# EAGLE schematic rpusb (EAGLE 9.6.2)

## Sheet 1 of 4: Block Diagram
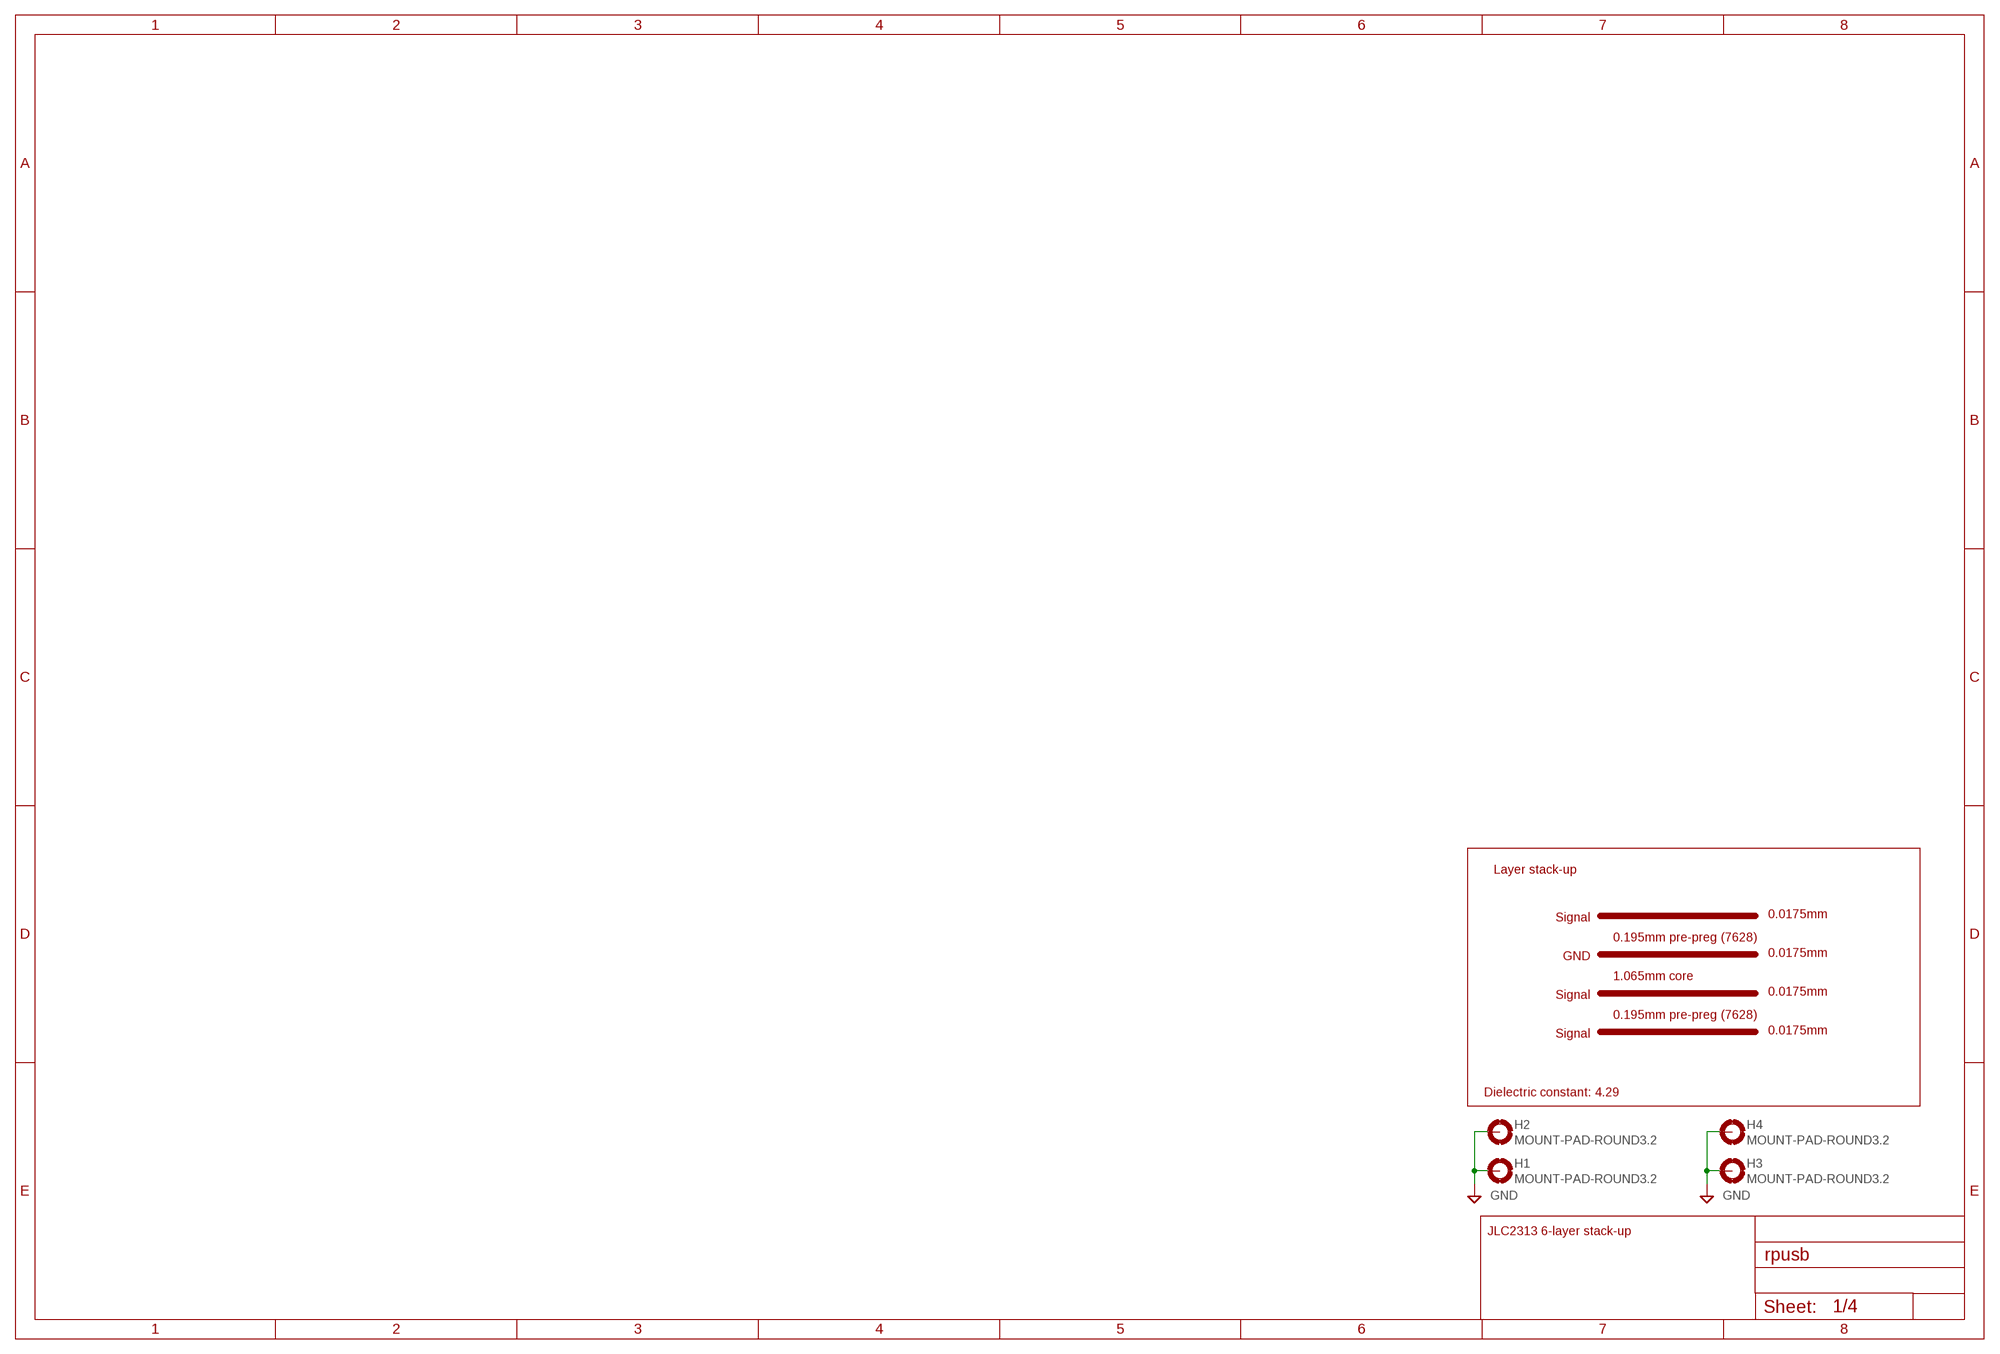
[diagram p0: schematic, sheet 1]

### Parts
H1  MOUNT-PAD-ROUND3.2  [3,2-PAD]
H2  MOUNT-PAD-ROUND3.2  [3,2-PAD]
H3  MOUNT-PAD-ROUND3.2  [3,2-PAD]
H4  MOUNT-PAD-ROUND3.2  [3,2-PAD]

### Nets
GND: H1.B3,2(MOUNT) H2.B3,2(MOUNT) H3.B3,2(MOUNT) H4.B3,2(MOUNT) ; also sheet 2,3,4

### Notes on the sheet
- Layer stack-up
- Signal
- 0.0175mm
- 0.195mm pre-preg (7628)
- GND
- 0.0175mm
- 1.065mm core
- Signal
- 0.0175mm
- 0.195mm pre-preg (7628)
- Signal
- 0.0175mm
- Dielectric constant: 4.29
- JLC2313 6-layer stack-up

## Sheet 2 of 4: USB hub
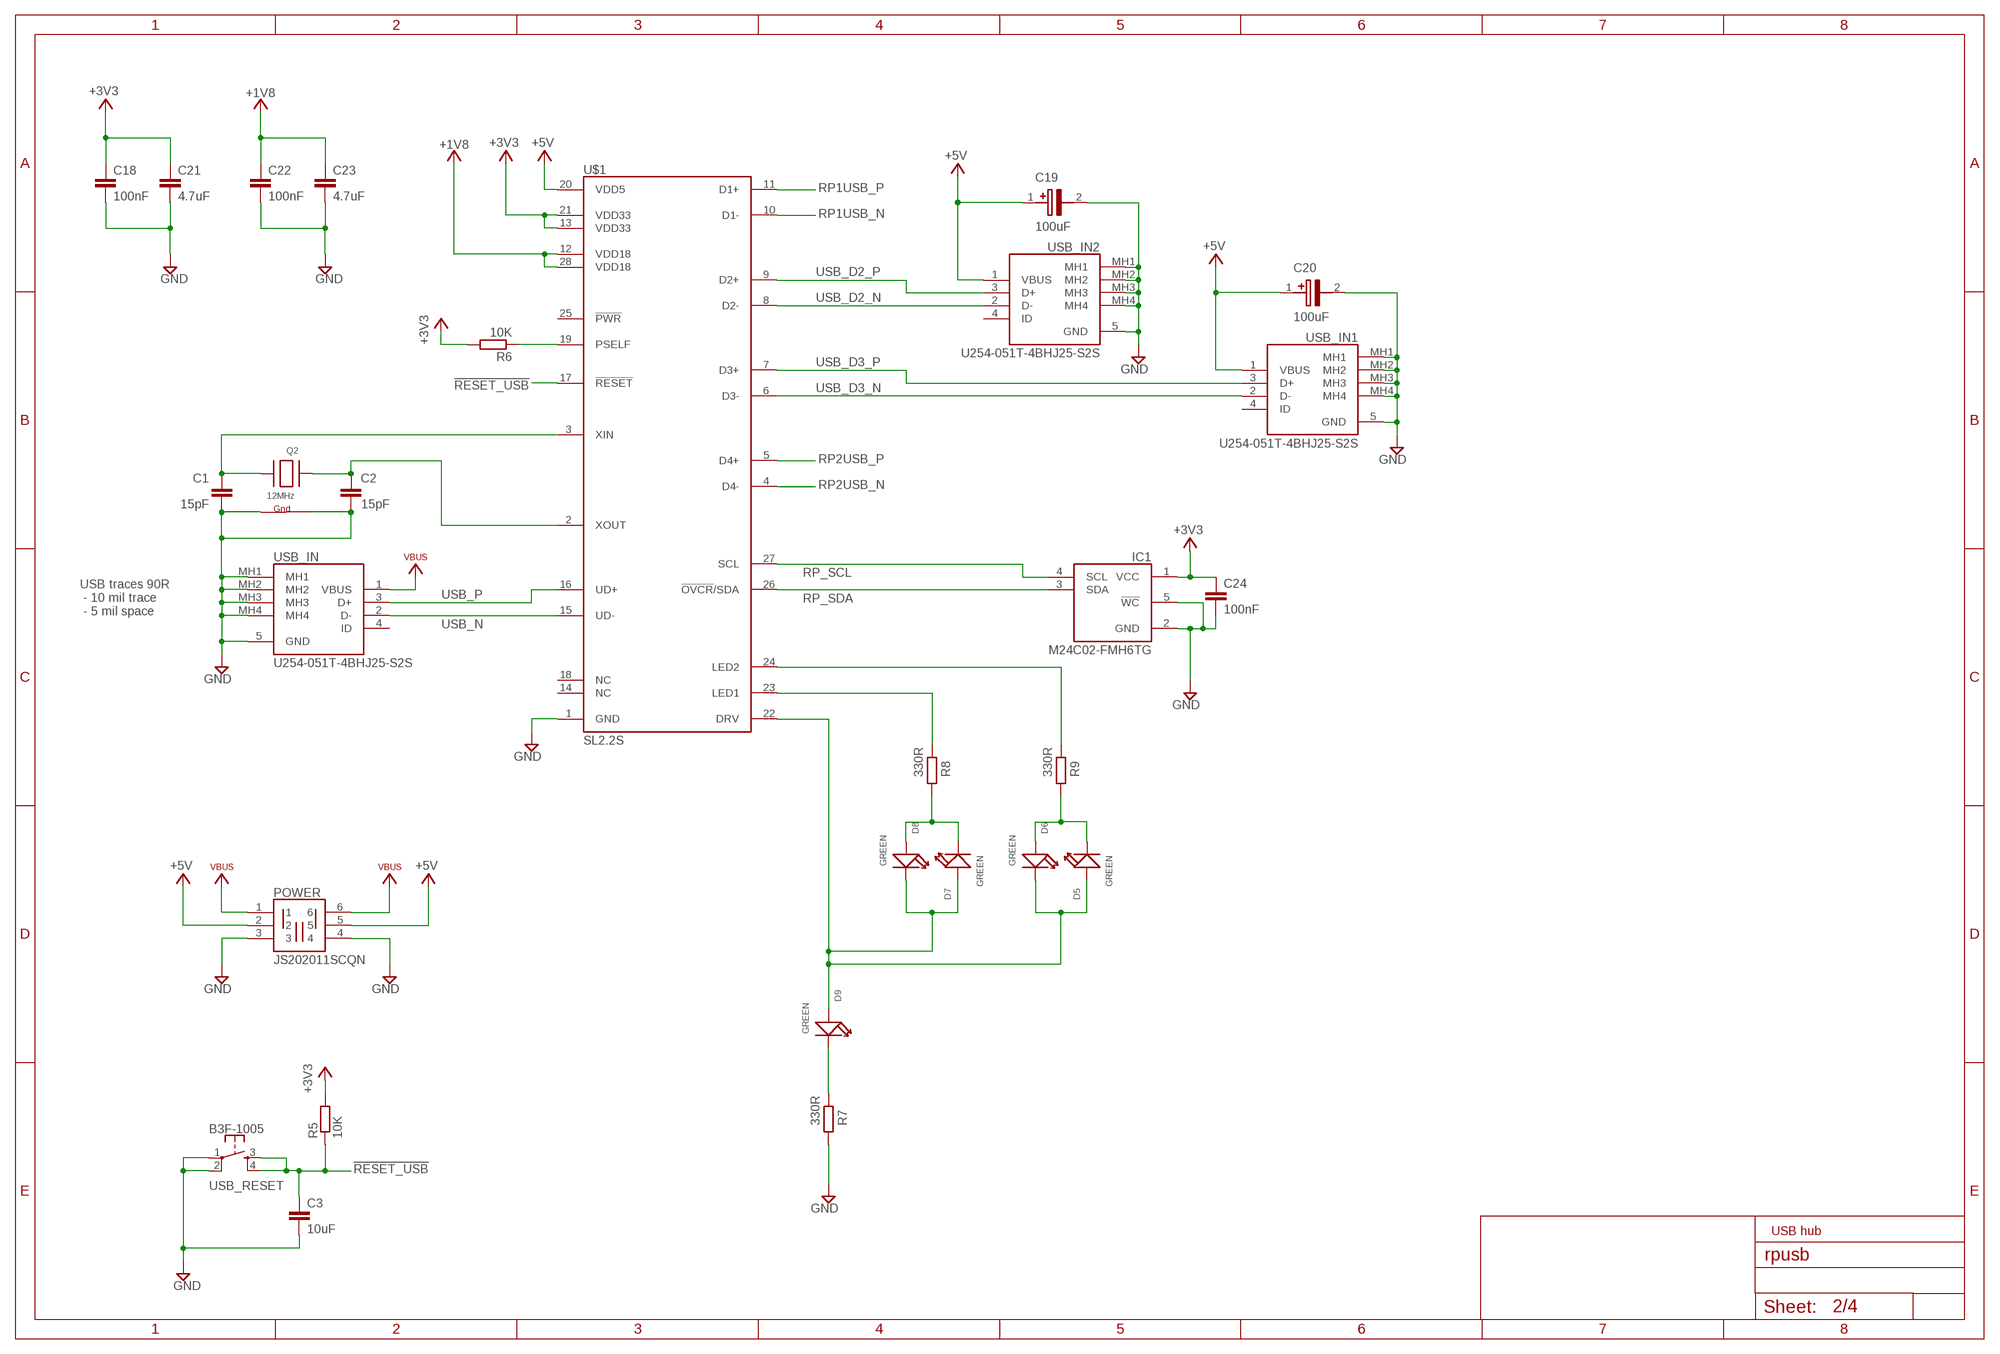
[diagram p1: schematic, sheet 2]

### Parts
C1  15pF  C-EUC0201  [C0201]
C2  15pF  C-EUC0201  [C0201]
C3  10uF  C-EUC0402  [C0402]
C18  100nF  C-EUC0201  [C0201]
C19  100uF  865080142007  [CAPAE530X550N]
C20  100uF  865080142007  [CAPAE530X550N]
C21  4.7uF  C-EUC0402  [C0402]
C22  100nF  C-EUC0201  [C0201]
C23  4.7uF  C-EUC0402  [C0402]
C24  100nF  C-EUC0201  [C0201]
D5  GREEN  SMD-LED-CLEAR-BLUE(0603)  [LED-0603]
D6  GREEN  SMD-LED-CLEAR-BLUE(0603)  [LED-0603]
D7  GREEN  SMD-LED-CLEAR-BLUE(0603)  [LED-0603]
D8  GREEN  SMD-LED-CLEAR-BLUE(0603)  [LED-0603]
D9  GREEN  SMD-LED-CLEAR-BLUE(0603)  [LED-0603]
IC1  M24C02-FMH6TG  [M24C32FMH6TG]
POWER  JS202011SCQN  [JS202011SCQN]
Q2  12MHz  XTAL-4-3225  [NX3225]
R5  10K  R-EU_R0201  [R0201]
R6  10K  R-EU_R0201  [R0201]
R7  330R  R-EU_R0201  [R0201]
R8  330R  R-EU_R0201  [R0201]
R9  330R  R-EU_R0201  [R0201]
U$1  SL2.2S  [SSOP28-0.635]
USB_IN  U254-051T-4BHJ25-S2S  [U254051T4BHJ25S2S]
USB_IN1  U254-051T-4BHJ25-S2S  [U254051T4BHJ25S2S]
USB_IN2  U254-051T-4BHJ25-S2S  [U254051T4BHJ25S2S]
USB_RESET  B3F-1005  TAC_SWITCHPTH  [TACTILE-PTH]

### Nets
!RESET_USB!: C3.1 R5.1 U$1.17(!RESET!) USB_RESET.3 USB_RESET.4
+1V8: C22.1 C23.1 U$1.12(VDD18) U$1.28(VDD18)
+3V3: C18.1 C21.1 C24.1 IC1.1(VCC) R5.2 R6.2 U$1.13(VDD33) U$1.21(VDD33)
+5V: C19.1(+) C20.1(+) POWER.2 POWER.5 U$1.20(VDD5) USB_IN1.1(VBUS) USB_IN2.1(VBUS) ; also sheet 4
GND: C1.2 C2.2 C3.2 C18.2 C19.2(-) C20.2(-) C21.2 C22.2 C23.2 C24.2 IC1.2(GND) IC1.5(!WC) POWER.3 POWER.4 Q2.2(G2) Q2.4(G1) R7.1 U$1.1(GND) USB_IN1.5(GND) USB_IN1.MH1 USB_IN1.MH2 USB_IN1.MH3 USB_IN1.MH4 USB_IN2.5(GND) USB_IN2.MH1 USB_IN2.MH2 USB_IN2.MH3 USB_IN2.MH4 USB_IN.5(GND) USB_IN.MH1 USB_IN.MH2 USB_IN.MH3 USB_IN.MH4 USB_RESET.1 USB_RESET.2 ; also sheet 1,3,4
N$2: D9.- R7.2
N$12: C2.1 Q2.3(X2) U$1.2(XOUT)
N$13: R6.1 U$1.19(PSELF)
N$14: C1.1 Q2.1(X1) U$1.3(XIN)
N$15: R8.2 U$1.23(LED1)
N$16: D7.- D8.+ R8.1
N$19: D5.+ D6.- D7.+ D8.- D9.+ U$1.22(DRV)
N$20: R9.2 U$1.24(LED2)
N$21: D5.- D6.+ R9.1
RP1USB_N [USB]: U$1.10(D1-) ; also sheet 3
RP1USB_P [USB]: U$1.11(D1+) ; also sheet 3
RP2USB_N [USB]: U$1.4(D4-) ; also sheet 4
RP2USB_P [USB]: U$1.5(D4+) ; also sheet 4
RP_SCL: IC1.4(SCL) U$1.27(SCL) ; also sheet 3
RP_SDA: IC1.3(SDA) U$1.26(!OVCR!/SDA) ; also sheet 3
USB_D2_N [USB]: U$1.8(D2-) USB_IN2.2(D-)
USB_D2_P [USB]: U$1.9(D2+) USB_IN2.3(D+)
USB_D3_N [USB]: U$1.6(D3-) USB_IN1.2(D-)
USB_D3_P [USB]: U$1.7(D3+) USB_IN1.3(D+)
USB_N [USB]: U$1.15(UD-) USB_IN.2(D-)
USB_P [USB]: U$1.16(UD+) USB_IN.3(D+)
VBUS: POWER.1 POWER.6 USB_IN.1(VBUS) ; also sheet 4
Unconnected: U$1.14(NC) U$1.18(NC) U$1.25(!PWR!) USB_IN1.4(ID) USB_IN2.4(ID) USB_IN.4(ID)

### Notes on the sheet
- USB traces 90R
   - 10 mil trace
   - 5 mil space
- USB hub

## Sheet 3 of 4: RP2040 #1
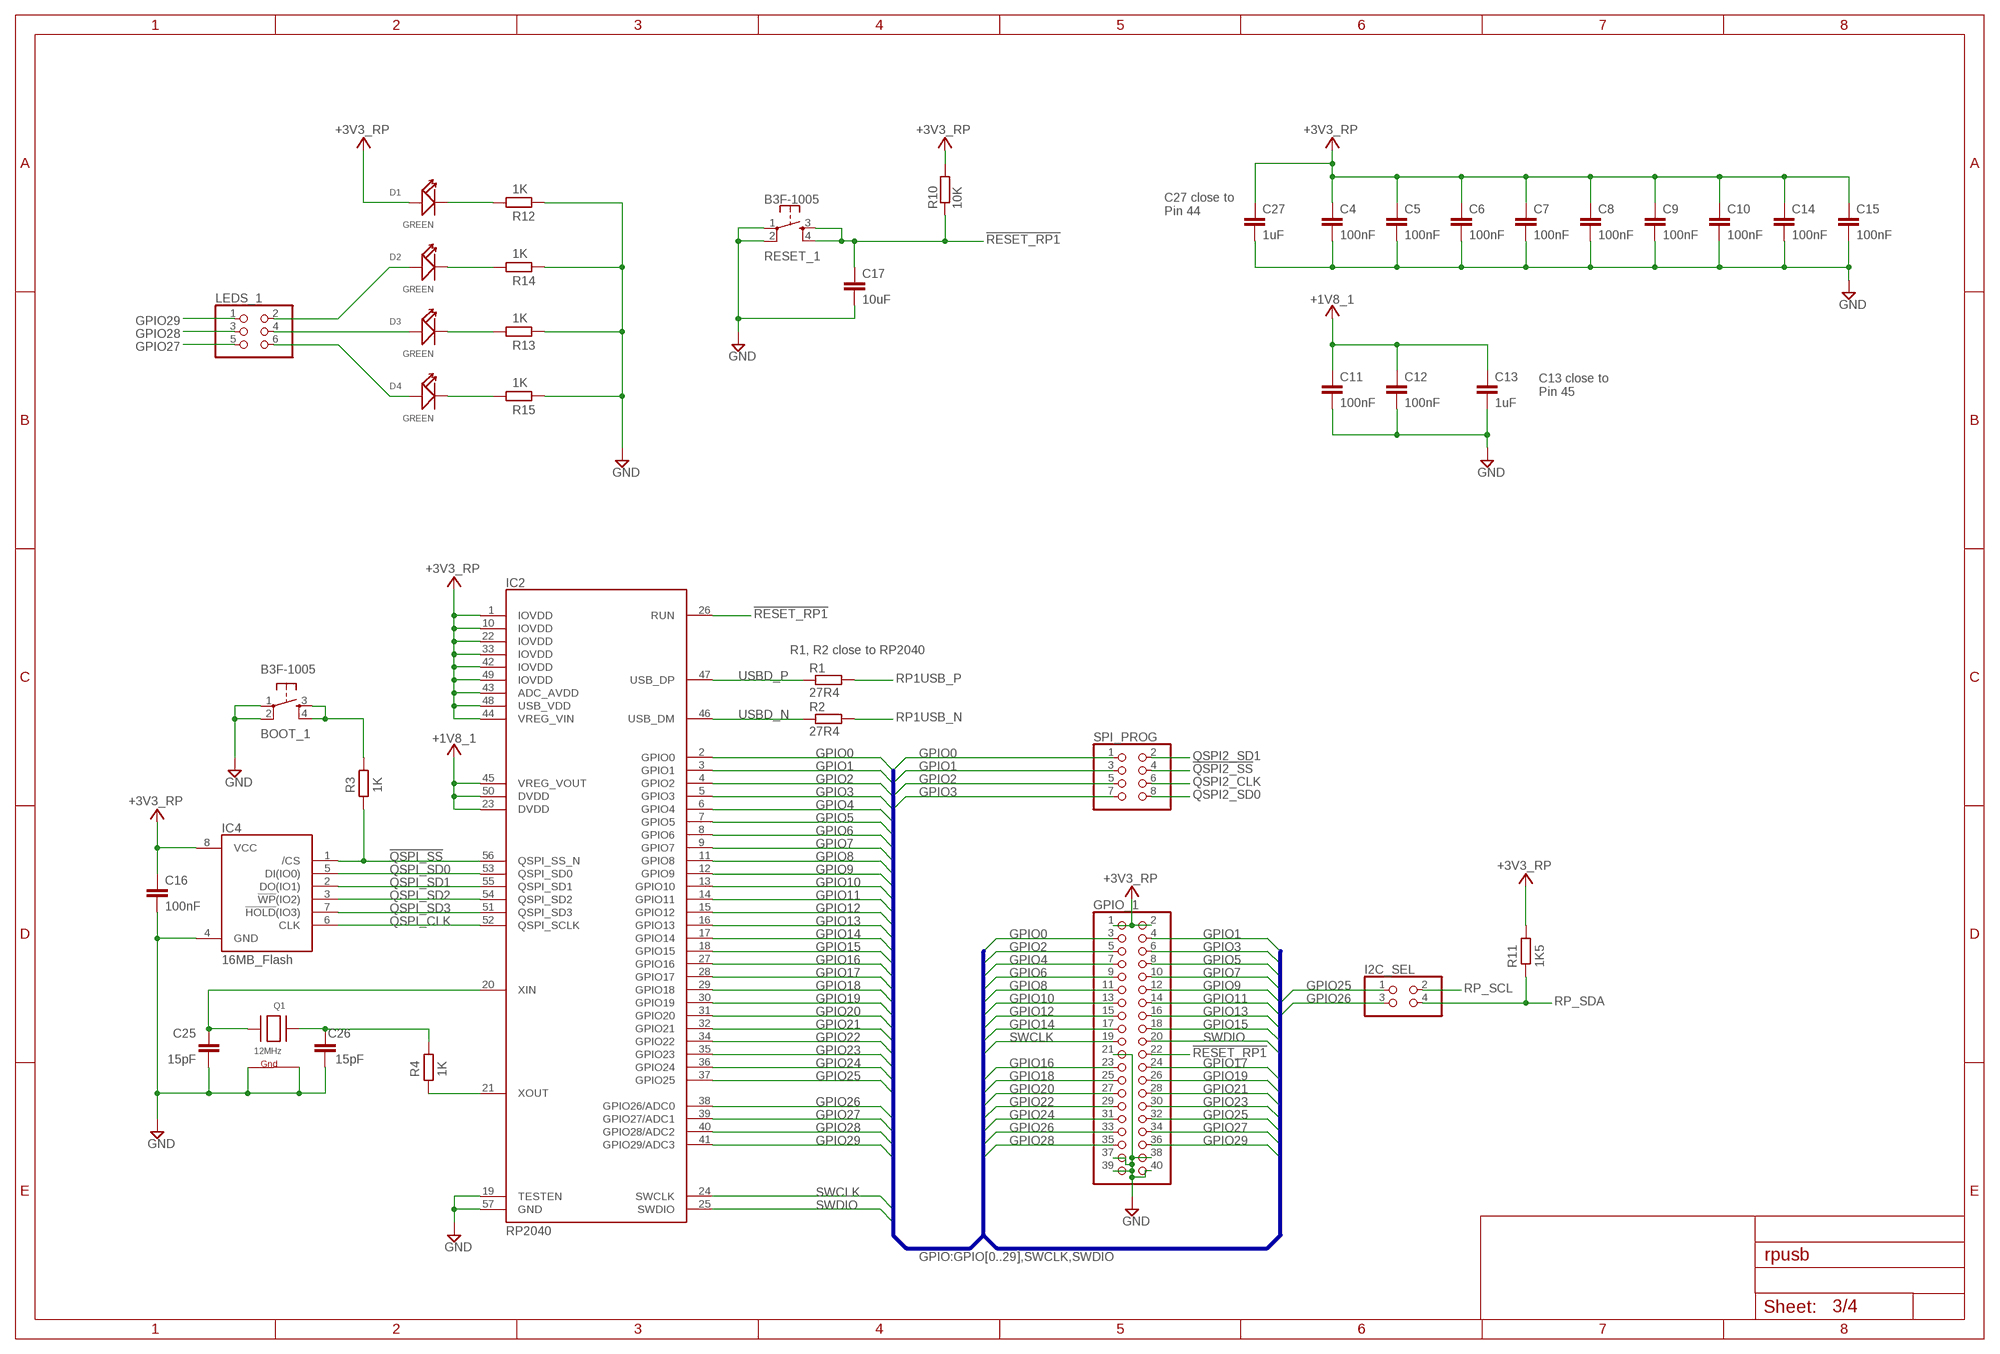
[diagram p2: schematic, sheet 3]

### Parts
BOOT_1  B3F-1005  TAC_SWITCHPTH  [TACTILE-PTH]
C4  100nF  C-EUC0201  [C0201]
C5  100nF  C-EUC0201  [C0201]
C6  100nF  C-EUC0201  [C0201]
C7  100nF  C-EUC0201  [C0201]
C8  100nF  C-EUC0201  [C0201]
C9  100nF  C-EUC0201  [C0201]
C10  100nF  C-EUC0201  [C0201]
C11  100nF  C-EUC0201  [C0201]
C12  100nF  C-EUC0201  [C0201]
C13  1uF  C-EUC0201  [C0201]
C14  100nF  C-EUC0201  [C0201]
C15  100nF  C-EUC0201  [C0201]
C16  100nF  C-EUC0201  [C0201]
C17  10uF  C-EUC0402  [C0402]
C25  15pF  C-EUC0201  [C0201]
C26  15pF  C-EUC0201  [C0201]
C27  1uF  C-EUC0201  [C0201]
D1  GREEN  SMD-LED-CLEAR-BLUE(0603)  [LED-0603]
D2  GREEN  SMD-LED-CLEAR-BLUE(0603)  [LED-0603]
D3  GREEN  SMD-LED-CLEAR-BLUE(0603)  [LED-0603]
D4  GREEN  SMD-LED-CLEAR-BLUE(0603)  [LED-0603]
GPIO_1  PINHD-2X20  [2X20]
I2C_SEL  PINHD-2X2  [2X02]
IC2  RP2040  [QFN40P700X700X90-57N]
IC4  16MB_Flash  W25Q128JVSIM_TR  [SOIC127P790X216-8N]
LEDS_1  PINHD-2X3  [2X03]
Q1  12MHz  XTAL-4-3225  [NX3225]
R1  27R4  R-EU_R0201  [R0201]
R2  27R4  R-EU_R0201  [R0201]
R3  1K  R-EU_R0201  [R0201]
R4  1K  R-EU_R0201  [R0201]
R10  10K  R-EU_R0201  [R0201]
R11  1K5  R-EU_R0201  [R0201]
R12  1K  R-EU_R0201  [R0201]
R13  1K  R-EU_R0201  [R0201]
R14  1K  R-EU_R0201  [R0201]
R15  1K  R-EU_R0201  [R0201]
RESET_1  B3F-1005  TAC_SWITCHPTH  [TACTILE-PTH]
SPI_PROG  PINHD-2X4  [2X04]

### Nets
!QSPI2_SS!: SPI_PROG.4 ; also sheet 4
!QSPI_SS!: IC2.56(QSPI_SS_N) IC4.1(/CS) R3.2
!RESET_RP1!: C17.1 GPIO_1.22 IC2.26(RUN) R10.1 RESET_1.3 RESET_1.4
+1V8_1: C11.1 C12.1 C13.1 IC2.23(DVDD) IC2.45(VREG_VOUT) IC2.50(DVDD)
+3V3_RP: C4.1 C5.1 C6.1 C7.1 C8.1 C9.1 C10.1 C14.1 C15.1 C16.1 C27.1 D1.+ GPIO_1.1 GPIO_1.2 IC2.1(IOVDD) IC2.10(IOVDD) IC2.22(IOVDD) IC2.33(IOVDD) IC2.42(IOVDD) IC2.43(ADC_AVDD) IC2.44(VREG_VIN) IC2.48(USB_VDD) IC2.49(IOVDD) IC4.8(VCC) R10.2 R11.1 ; also sheet 4
GND: BOOT_1.1 BOOT_1.2 C4.2 C5.2 C6.2 C7.2 C8.2 C9.2 C10.2 C11.2 C12.2 C13.2 C14.2 C15.2 C16.2 C17.2 C25.2 C26.2 C27.2 GPIO_1.21 GPIO_1.37 GPIO_1.38 GPIO_1.39 GPIO_1.40 IC2.19(TESTEN) IC2.57(GND) IC4.4(GND) Q1.2(G2) Q1.4(G1) R12.2 R13.2 R14.2 R15.2 RESET_1.1 RESET_1.2 ; also sheet 1,2,4
GPIO0: GPIO_1.3 IC2.2(GPIO0) SPI_PROG.1
GPIO1: GPIO_1.4 IC2.3(GPIO1) SPI_PROG.3
GPIO2: GPIO_1.5 IC2.4(GPIO2) SPI_PROG.5
GPIO3: GPIO_1.6 IC2.5(GPIO3) SPI_PROG.7
GPIO4: GPIO_1.7 IC2.6(GPIO4)
GPIO5: GPIO_1.8 IC2.7(GPIO5)
GPIO6: GPIO_1.9 IC2.8(GPIO6)
GPIO7: GPIO_1.10 IC2.9(GPIO7)
GPIO8: GPIO_1.11 IC2.11(GPIO8)
GPIO9: GPIO_1.12 IC2.12(GPIO9)
GPIO10: GPIO_1.13 IC2.13(GPIO10)
GPIO11: GPIO_1.14 IC2.14(GPIO11)
GPIO12: GPIO_1.15 IC2.15(GPIO12)
GPIO13: GPIO_1.16 IC2.16(GPIO13)
GPIO14: GPIO_1.17 IC2.17(GPIO14)
GPIO15: GPIO_1.18 IC2.18(GPIO15)
GPIO16: GPIO_1.23 IC2.27(GPIO16)
GPIO17: GPIO_1.24 IC2.28(GPIO17)
GPIO18: GPIO_1.25 IC2.29(GPIO18)
GPIO19: GPIO_1.26 IC2.30(GPIO19)
GPIO20: GPIO_1.27 IC2.31(GPIO20)
GPIO21: GPIO_1.28 IC2.32(GPIO21)
GPIO22: GPIO_1.29 IC2.34(GPIO22)
GPIO23: GPIO_1.30 IC2.35(GPIO23)
GPIO24: GPIO_1.31 IC2.36(GPIO24)
GPIO25: GPIO_1.32 I2C_SEL.1 IC2.37(GPIO25)
GPIO26: GPIO_1.33 I2C_SEL.3 IC2.38(GPIO26/ADC0)
GPIO27: GPIO_1.34 IC2.39(GPIO27/ADC1) LEDS_1.5
GPIO28: GPIO_1.35 IC2.40(GPIO28/ADC2) LEDS_1.3
GPIO29: GPIO_1.36 IC2.41(GPIO29/ADC3) LEDS_1.1
N$3: D1.- R12.1
N$4: D2.- R14.1
N$5: BOOT_1.3 BOOT_1.4 R3.1
N$6: D3.- R13.1
N$7: IC2.21(XOUT) R4.2
N$8: D4.- R15.1
N$9: D2.+ LEDS_1.2
N$10: D3.+ LEDS_1.4
N$11: D4.+ LEDS_1.6
N$17: C26.1 Q1.3(X2) R4.1
N$18: C25.1 IC2.20(XIN) Q1.1(X1)
QSPI2_CLK: SPI_PROG.6 ; also sheet 4
QSPI2_SD0: SPI_PROG.8 ; also sheet 4
QSPI2_SD1: SPI_PROG.2 ; also sheet 4
QSPI_CLK: IC2.52(QSPI_SCLK) IC4.6(CLK)
QSPI_SD0: IC2.53(QSPI_SD0) IC4.5(DI(IO0))
QSPI_SD1: IC2.55(QSPI_SD1) IC4.2(DO(IO1))
QSPI_SD2: IC2.54(QSPI_SD2) IC4.3(!WP!(IO2))
QSPI_SD3: IC2.51(QSPI_SD3) IC4.7(!HOLD!(IO3))
RP1USB_N [USB]: R2.2 ; also sheet 2
RP1USB_P [USB]: R1.2 ; also sheet 2
RP_SCL: I2C_SEL.2 ; also sheet 2
RP_SDA: I2C_SEL.4 R11.2 ; also sheet 2
SWCLK: GPIO_1.19 IC2.24(SWCLK)
SWDIO: GPIO_1.20 IC2.25(SWDIO)
USBD_N [USB]: IC2.46(USB_DM) R2.1
USBD_P [USB]: IC2.47(USB_DP) R1.1

### Buses
GPIO:GPIO[0..29],SWCLK,SWDIO

### Notes on the sheet
- C27 close to
  Pin 44
- C13 close to
  Pin 45
- R1, R2 close to RP2040

## Sheet 4 of 4: RP2040 #2
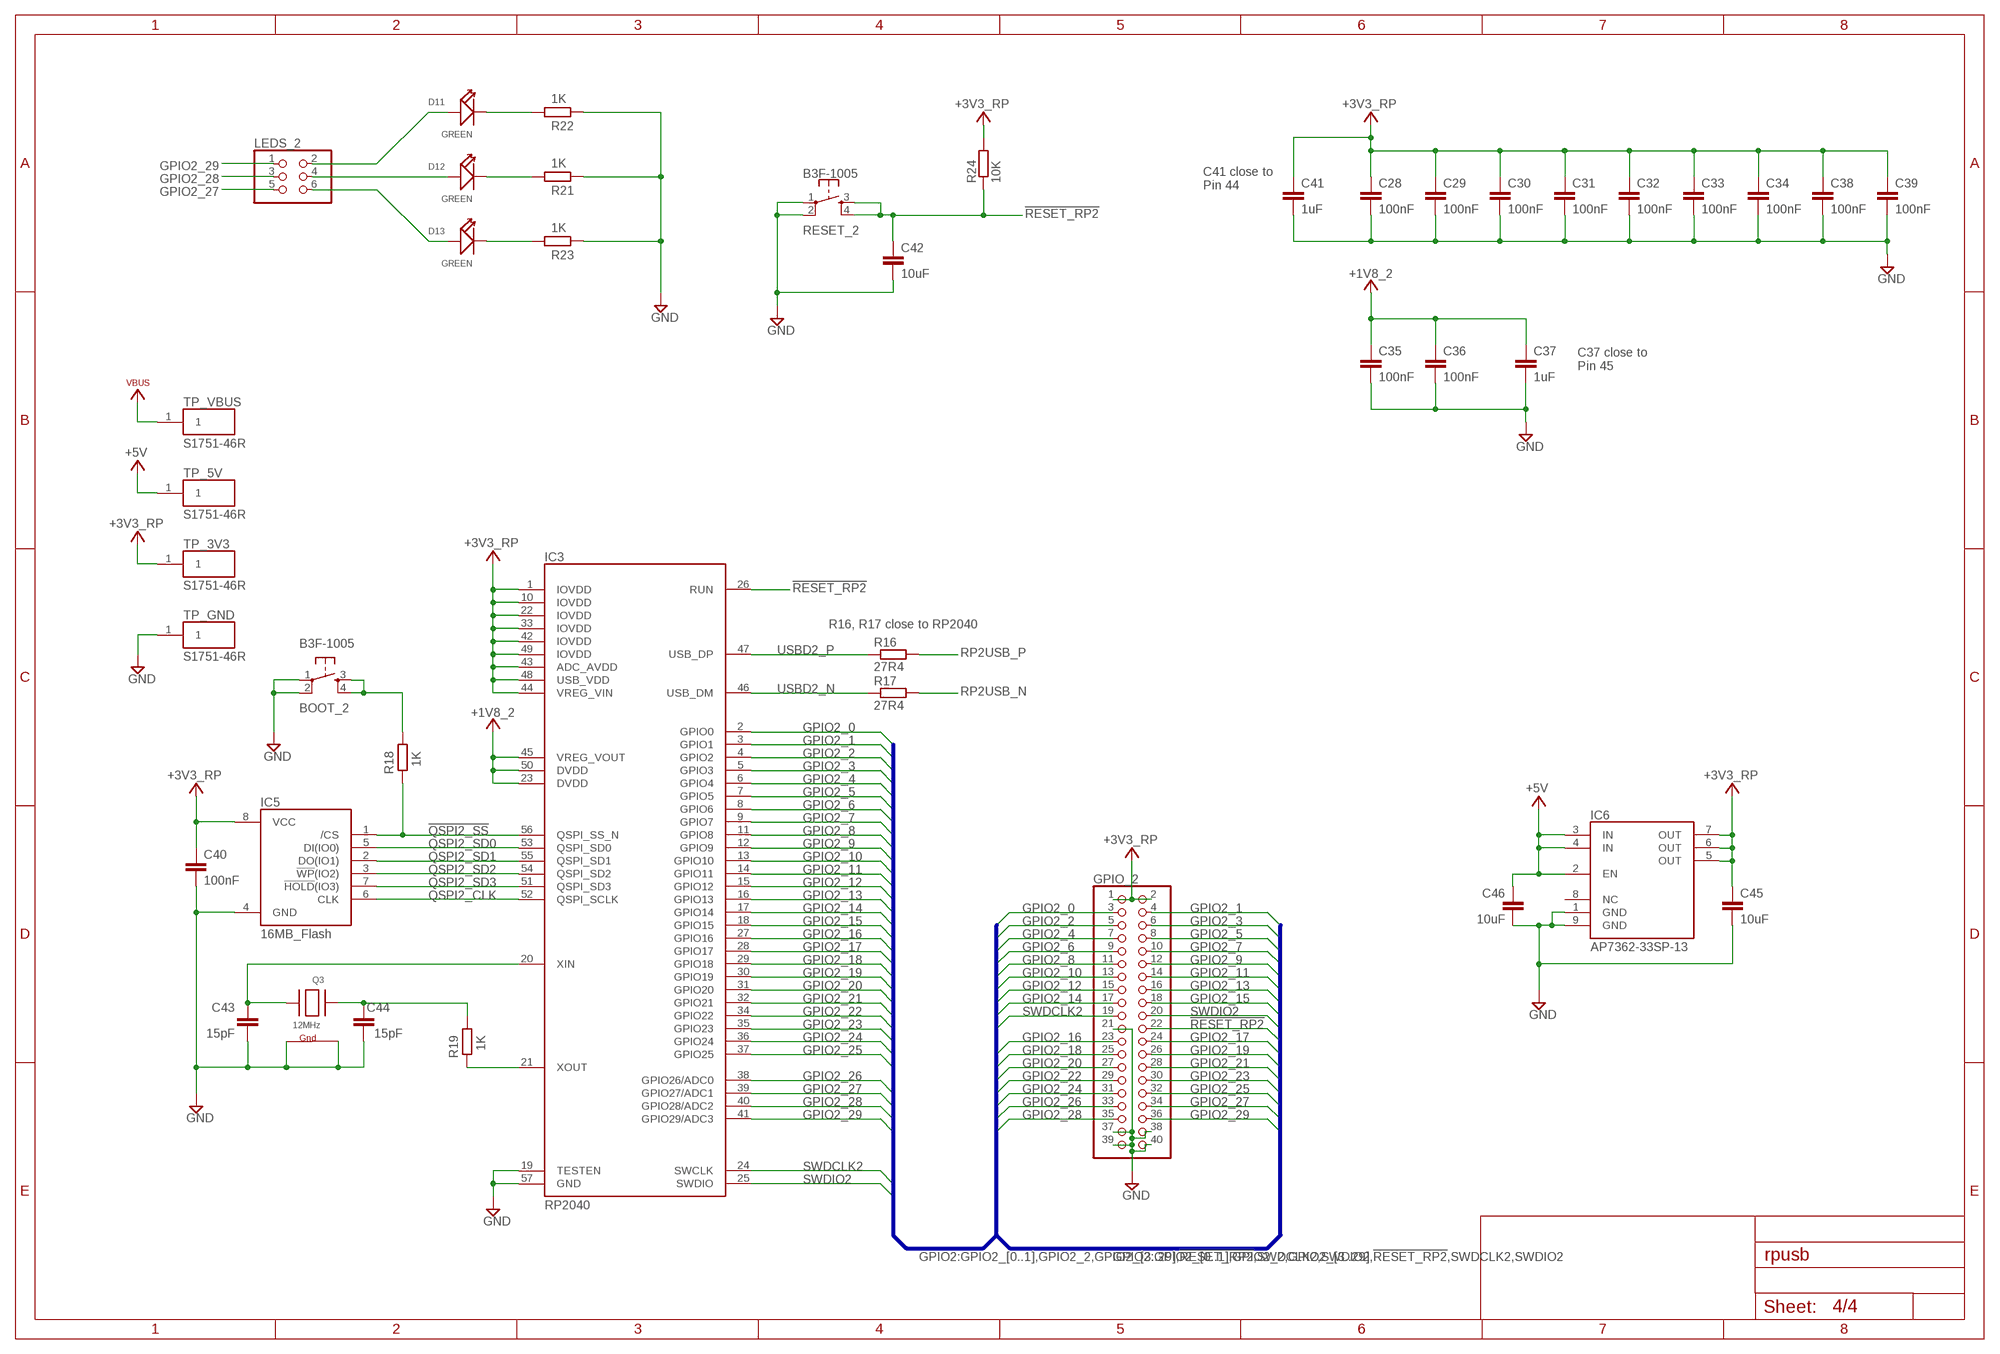
[diagram p3: schematic, sheet 4]

### Parts
BOOT_2  B3F-1005  TAC_SWITCHPTH  [TACTILE-PTH]
C28  100nF  C-EUC0201  [C0201]
C29  100nF  C-EUC0201  [C0201]
C30  100nF  C-EUC0201  [C0201]
C31  100nF  C-EUC0201  [C0201]
C32  100nF  C-EUC0201  [C0201]
C33  100nF  C-EUC0201  [C0201]
C34  100nF  C-EUC0201  [C0201]
C35  100nF  C-EUC0201  [C0201]
C36  100nF  C-EUC0201  [C0201]
C37  1uF  C-EUC0201  [C0201]
C38  100nF  C-EUC0201  [C0201]
C39  100nF  C-EUC0201  [C0201]
C40  100nF  C-EUC0201  [C0201]
C41  1uF  C-EUC0201  [C0201]
C42  10uF  C-EUC0402  [C0402]
C43  15pF  C-EUC0201  [C0201]
C44  15pF  C-EUC0201  [C0201]
C45  10uF  C-EUC0402  [C0402]
C46  10uF  C-EUC0402  [C0402]
D11  GREEN  SMD-LED-CLEAR-BLUE(0603)  [LED-0603]
D12  GREEN  SMD-LED-CLEAR-BLUE(0603)  [LED-0603]
D13  GREEN  SMD-LED-CLEAR-BLUE(0603)  [LED-0603]
GPIO_2  PINHD-2X20  [2X20]
IC3  RP2040  [QFN40P700X700X90-57N]
IC5  16MB_Flash  W25Q128JVSIM_TR  [SOIC127P790X216-8N]
IC6  AP7362-33SP-13  [SOIC127P600X163-9N]
LEDS_2  PINHD-2X3  [2X03]
Q3  12MHz  XTAL-4-3225  [NX3225]
R16  27R4  R-EU_R0201  [R0201]
R17  27R4  R-EU_R0201  [R0201]
R18  1K  R-EU_R0201  [R0201]
R19  1K  R-EU_R0201  [R0201]
R21  1K  R-EU_R0201  [R0201]
R22  1K  R-EU_R0201  [R0201]
R23  1K  R-EU_R0201  [R0201]
R24  10K  R-EU_R0201  [R0201]
RESET_2  B3F-1005  TAC_SWITCHPTH  [TACTILE-PTH]
TP_3V3  S1751-46R  [S175146R]
TP_5V  S1751-46R  [S175146R]
TP_GND  S1751-46R  [S175146R]
TP_VBUS  S1751-46R  [S175146R]

### Nets
!QSPI2_SS!: IC3.56(QSPI_SS_N) IC5.1(/CS) R18.2 ; also sheet 3
!RESET_RP2!: C42.1 GPIO_2.22 IC3.26(RUN) R24.1 RESET_2.3 RESET_2.4
+1V8_2: C35.1 C36.1 C37.1 IC3.23(DVDD) IC3.45(VREG_VOUT) IC3.50(DVDD)
+3V3_RP: C28.1 C29.1 C30.1 C31.1 C32.1 C33.1 C34.1 C38.1 C39.1 C40.1 C41.1 C45.1 GPIO_2.1 GPIO_2.2 IC3.1(IOVDD) IC3.10(IOVDD) IC3.22(IOVDD) IC3.33(IOVDD) IC3.42(IOVDD) IC3.43(ADC_AVDD) IC3.44(VREG_VIN) IC3.48(USB_VDD) IC3.49(IOVDD) IC5.8(VCC) IC6.5(OUT) IC6.6(OUT) IC6.7(OUT) R24.2 TP_3V3.1 ; also sheet 3
+5V: C46.1 IC6.2(EN) IC6.3(IN) IC6.4(IN) TP_5V.1 ; also sheet 2
GND: BOOT_2.1 BOOT_2.2 C28.2 C29.2 C30.2 C31.2 C32.2 C33.2 C34.2 C35.2 C36.2 C37.2 C38.2 C39.2 C40.2 C41.2 C42.2 C43.2 C44.2 C45.2 C46.2 GPIO_2.21 GPIO_2.37 GPIO_2.38 GPIO_2.39 GPIO_2.40 IC3.19(TESTEN) IC3.57(GND) IC5.4(GND) IC6.1(GND) IC6.9(GND) Q3.2(G2) Q3.4(G1) R21.2 R22.2 R23.2 RESET_2.1 RESET_2.2 TP_GND.1 ; also sheet 1,2,3
GPIO2_0: GPIO_2.3 IC3.2(GPIO0)
GPIO2_1: GPIO_2.4 IC3.3(GPIO1)
GPIO2_2: GPIO_2.5 IC3.4(GPIO2)
GPIO2_3: GPIO_2.6 IC3.5(GPIO3)
GPIO2_4: GPIO_2.7 IC3.6(GPIO4)
GPIO2_5: GPIO_2.8 IC3.7(GPIO5)
GPIO2_6: GPIO_2.9 IC3.8(GPIO6)
GPIO2_7: GPIO_2.10 IC3.9(GPIO7)
GPIO2_8: GPIO_2.11 IC3.11(GPIO8)
GPIO2_9: GPIO_2.12 IC3.12(GPIO9)
GPIO2_10: GPIO_2.13 IC3.13(GPIO10)
GPIO2_11: GPIO_2.14 IC3.14(GPIO11)
GPIO2_12: GPIO_2.15 IC3.15(GPIO12)
GPIO2_13: GPIO_2.16 IC3.16(GPIO13)
GPIO2_14: GPIO_2.17 IC3.17(GPIO14)
GPIO2_15: GPIO_2.18 IC3.18(GPIO15)
GPIO2_16: GPIO_2.23 IC3.27(GPIO16)
GPIO2_17: GPIO_2.24 IC3.28(GPIO17)
GPIO2_18: GPIO_2.25 IC3.29(GPIO18)
GPIO2_19: GPIO_2.26 IC3.30(GPIO19)
GPIO2_20: GPIO_2.27 IC3.31(GPIO20)
GPIO2_21: GPIO_2.28 IC3.32(GPIO21)
GPIO2_22: GPIO_2.29 IC3.34(GPIO22)
GPIO2_23: GPIO_2.30 IC3.35(GPIO23)
GPIO2_24: GPIO_2.31 IC3.36(GPIO24)
GPIO2_25: GPIO_2.32 IC3.37(GPIO25)
GPIO2_26: GPIO_2.33 IC3.38(GPIO26/ADC0)
GPIO2_27: GPIO_2.34 IC3.39(GPIO27/ADC1) LEDS_2.5
GPIO2_28: GPIO_2.35 IC3.40(GPIO28/ADC2) LEDS_2.3
GPIO2_29: GPIO_2.36 IC3.41(GPIO29/ADC3) LEDS_2.1
N$1: BOOT_2.3 BOOT_2.4 R18.1
N$22: IC3.21(XOUT) R19.2
N$24: D11.- R22.1
N$25: D12.- R21.1
N$26: D13.- R23.1
N$27: D11.+ LEDS_2.2
N$28: D12.+ LEDS_2.4
N$29: D13.+ LEDS_2.6
N$30: C44.1 Q3.3(X2) R19.1
N$31: C43.1 IC3.20(XIN) Q3.1(X1)
QSPI2_CLK: IC3.52(QSPI_SCLK) IC5.6(CLK) ; also sheet 3
QSPI2_SD0: IC3.53(QSPI_SD0) IC5.5(DI(IO0)) ; also sheet 3
QSPI2_SD1: IC3.55(QSPI_SD1) IC5.2(DO(IO1)) ; also sheet 3
QSPI2_SD2: IC3.54(QSPI_SD2) IC5.3(!WP!(IO2))
QSPI2_SD3: IC3.51(QSPI_SD3) IC5.7(!HOLD!(IO3))
RP2USB_N [USB]: R17.2 ; also sheet 2
RP2USB_P [USB]: R16.2 ; also sheet 2
SWDCLK2: GPIO_2.19 IC3.24(SWCLK)
SWDIO2: GPIO_2.20 IC3.25(SWDIO)
USBD2_N [USB]: IC3.46(USB_DM) R17.1
USBD2_P [USB]: IC3.47(USB_DP) R16.1
VBUS: TP_VBUS.1 ; also sheet 2
Unconnected: IC6.8(NC)

### Buses
GPIO2:GPIO2_[0..1],GPIO2_2,GPIO2_[3..29],!RESET_RP2!,SWDCLK2,SWDIO2

### Notes on the sheet
- C41 close to
  Pin 44
- C37 close to
  Pin 45
- R16, R17 close to RP2040

## Library data of the parts
BOOT_1 BOOT_2 RESET_1 RESET_2 USB_RESET = SparkFun:TAC_SWITCH: Momentary Switch Button commonly used for reset or general input. Spark Fun Electronics SKU : COM-00097; USE: B3F-1005
C1 C2 C25 C26 C43 C44 = rcl:C-EU: CAPACITOR, European symbol; SPICEPREFIX: C; USE: 0201N150J500CT
C3 C17 C42 C45 C46 = rcl:C-EU: CAPACITOR, European symbol; SPICEPREFIX: C; USE: CL05A106MP5NUNC
C4-C12 C14-C16 C18 C22 C24 C28-C36 C38-C40 = rcl:C-EU: CAPACITOR, European symbol; SPICEPREFIX: C; USE: 0201X104M160CT
C13 C27 C37 C41 = rcl:C-EU: CAPACITOR, European symbol; SPICEPREFIX: C; USE: 0201B102K250CT
C19 C20 = samacsys:865080142007: Wurth Elektronik 100uF 25 V dc Aluminium Electrolytic Capacitor, WCAP-ASLI Series 2000h 5 (Dia.) x 5.35mm Source: Datasheet <https://katalog.we-online.com/pbs/datasheet/865080142007.pdf>; DESCRIPTION: Wurth Elektronik 100uF 25 V dc Aluminium Electrolytic Capacitor, WCAP-ASLI Series 2000h 5 (Dia.) x 5.35mm; HEIGHT: 5.5mm; MANUFACTURER_NAME: Wurth Elektronik; MANUFACTURER_PART_NUMBER: 865080142007; MOUSER_PART_NUMBER: 710-865080142007; MOUSER_PRICE-STOCK: https://www.mouser.co.uk/ProductDetail/Wurth-Elektronik/865080142007?qs=0KOYDY2FL2%2Fwso3YmuIP2w%3D%3D; USE: 865080142007
C21 C23 = rcl:C-EU: CAPACITOR, European symbol; SPICEPREFIX: C; USE: CL05A475MP5NRNC
D1-D9 D11-D13 = Seeed-LED:SMD-LED-CLEAR-BLUE(0603): 304090045; MPN: 19-217-BHC-ZL1M2RY-3T; USE: B1931NG--20D001114U1930; VALUE: BLUE-0603
GPIO_1 GPIO_2 = pinhead:PINHD-2X20: PIN HEADER
H1-H4 = holes:MOUNT-PAD-ROUND: MOUNTING PAD, round
I2C_SEL = pinhead:PINHD-2X2: PIN HEADER
IC1 = samacsys:M24C02-FMH6TG: STMICROELECTRONICS - M24C02-FMH6TG - EEPROM, 2 Kbit, 256 x 8bit, Serial I2C (2-Wire), 400 kHz, DFN, 5 Pins Source: Datasheet <https://componentsearchengine.com/Datasheets/1/M24C02-FMH6TG.pdf>; ARROW_PART_NUMBER: M24C02-FMH6TG; ARROW_PRICE-STOCK: https://www.arrow.com/en/products/m24c02-fmh6tg/stmicroelectronics?region=nac; DESCRIPTION: STMICROELECTRONICS - M24C02-FMH6TG - EEPROM, 2 Kbit, 256 x 8bit, Serial I2C (2-Wire), 400 kHz, DFN, 5 Pins; HEIGHT: 0.6mm; MANUFACTURER_NAME: STMicroelectronics; MANUFACTURER_PART_NUMBER: M24C02-FMH6TG; MOUSER_PART_NUMBER: 511-M24C02-FMH6TG; MOUSER_PRICE-STOCK: https://www.mouser.co.uk/ProductDetail/STMicroelectronics/M24C02-FMH6TG?qs=HXFqYaX1Q2xoDSakaDT8AQ%3D%3D; USE: M24C02-FMH6TG
IC2 IC3 = samacsys:RP2040: Microcontroller in QFN Package Source: Datasheet <https://datasheets.raspberrypi.org/rp2040/rp2040-datasheet.pdf>; DESCRIPTION: Microcontroller in QFN Package; HEIGHT: 0.9mm; MANUFACTURER_NAME: RASPBERRY-PI; MANUFACTURER_PART_NUMBER: RP2040; USE: SC0914(13)
IC4 IC5 = samacsys:W25Q128JVSIM_TR: 3V 128M-BIT SERIAL FLASH MEMORY WITH DUAL/QUAD SPI & QPI & DTR Source: Datasheet <http://www.winbond.com/resource-files/w25q128jv dtr revb 11042016.pdf>; ARROW_PART_NUMBER: W25Q128JVSIM TR; ARROW_PRICE-STOCK: https://www.arrow.com/en/products/w25q128jvsimtr/winbond-electronics?region=nac; DESCRIPTION: 3V 128M-BIT SERIAL FLASH MEMORY WITH DUAL/QUAD SPI & QPI & DTR; HEIGHT: 2.16mm; MANUFACTURER_NAME: Winbond; MANUFACTURER_PART_NUMBER: W25Q128JVSIM TR; MOUSER_PART_NUMBER: 454-W25Q128JVSIMTR; MOUSER_PRICE-STOCK: https://www.mouser.co.uk/ProductDetail/Winbond/W25Q128JVSIM-TR?qs=qSfuJ%252Bfl%2Fd6ji9IuruL6Zg%3D%3D; USE: W25Q128JVSIM
IC6 = samacsys:AP7362-33SP-13: LDO Voltage Regulators LDO CMOS HiCurr SO-8 1.5A LowQ Adj 190mV Source: Datasheet <https://componentsearchengine.com/Datasheets/1/AP7362-33SP-13.pdf>; ARROW_PART_NUMBER: AP7362-33SP-13; ARROW_PRICE-STOCK: https://www.arrow.com/en/products/ap7362-33sp-13/diodes-incorporated?region=nac; DESCRIPTION: LDO Voltage Regulators LDO CMOS HiCurr SO-8 1.5A LowQ Adj 190mV; HEIGHT: 1.63mm; MANUFACTURER_NAME: Diodes Inc.; MANUFACTURER_PART_NUMBER: AP7362-33SP-13; MOUSER_PART_NUMBER: 621-AP7362-33SP-13; MOUSER_PRICE-STOCK: https://www.mouser.co.uk/ProductDetail/Diodes-Incorporated/AP7362-33SP-13?qs=KKV7F4CK8NmzeNAjtGP7xA%3D%3D; USE: AP7362-33SP-13
LEDS_1 LEDS_2 = pinhead:PINHD-2X3: PIN HEADER
POWER = samacsys:JS202011SCQN: Sub miniature slide switches Source: Datasheet <http://www.ckswitches.com/media/1422/js.pdf>; ARROW_PART_NUMBER: JS202011SCQN; ARROW_PRICE-STOCK: https://www.arrow.com/en/products/js202011scqn/ck?region=nac; DESCRIPTION: Sub miniature slide switches; HEIGHT: 5.5mm; MANUFACTURER_NAME: C & K COMPONENTS; MANUFACTURER_PART_NUMBER: JS202011SCQN; MOUSER_PART_NUMBER: 611-JS202011SCQN; MOUSER_PRICE-STOCK: https://www.mouser.co.uk/ProductDetail/CK/JS202011SCQN?qs=LgMIjt8LuD95JYWxZ7NvZA%3D%3D; USE: JS202011SCQN
Q1-Q3 = adafruit:XTAL-4: Classic 4-pin 3.2 x 2.5mm crystal; USE: RH100-12.000-9-1015-TR-NS1
R1 R2 R16 R17 = rcl:R-EU_: RESISTOR, European symbol; SPICEPREFIX: R; USE: RC0201FR-0727R4L
R3 R4 R12-R15 R18 R19 R21-R23 = rcl:R-EU_: RESISTOR, European symbol; SPICEPREFIX: R; USE: RC0201FR-071KL
R5 R6 R10 R24 = rcl:R-EU_: RESISTOR, European symbol; SPICEPREFIX: R; USE: CR0201-JW-103GLF
R7-R9 = rcl:R-EU_: RESISTOR, European symbol; SPICEPREFIX: R; USE: RMCF0201FT330R
R11 = rcl:R-EU_: RESISTOR, European symbol; SPICEPREFIX: R; USE: RMCF0201FT1K50
SPI_PROG = pinhead:PINHD-2X4: PIN HEADER
TP_3V3 TP_5V TP_GND TP_VBUS = samacsys:S1751-46R: EZ_Boardware SMT Test Point 2.0mm high S1751-46R, Brass Grounding Contact Used with Surface Mount, 3.25 x 2 x 1.65 Source: Datasheet <https://cdn.harwin.com/pdfs/S1751R.pdf>; DESCRIPTION: EZ_Boardware SMT Test Point 2.0mm high S1751-46R, Brass Grounding Contact Used with Surface Mount, 3.25 x 2 x 1.65; HEIGHT: 2mm; MANUFACTURER_NAME: Harwin; MANUFACTURER_PART_NUMBER: S1751-46R; MOUSER_PART_NUMBER: 855-S1751-46R; MOUSER_PRICE-STOCK: https://www.mouser.co.uk/ProductDetail/Harwin/S1751-46R?qs=l6ZPVqNVZb71wETAKrfRig%3D%3D; USE: S1751-46
U$1 = sjg-usb:SL2.2S: SL2.2s High, Full and Low speed USB2 hub LCSC distributor; USE: SL2.2s
USB_IN USB_IN1 USB_IN2 = samacsys:U254-051T-4BHJ25-S2S: USB Connectors SMD RoHS Source: Datasheet <http://www.helloxkb.com/public/images/pdf/U254-051T-4BHJ25-S2S-.pdf>; DESCRIPTION: USB Connectors SMD RoHS; HEIGHT: 2.9mm; MANUFACTURER_NAME: XKB Connectivity; MANUFACTURER_PART_NUMBER: U254-051T-4BHJ25-S2S; USE: U254-051T-4BHJ25-S2S

## Net classes
0 default: width 0.152 mm
1 USB: width 0.254 mm, clearance 0.127 mm to class 0, clearance 0.127 mm